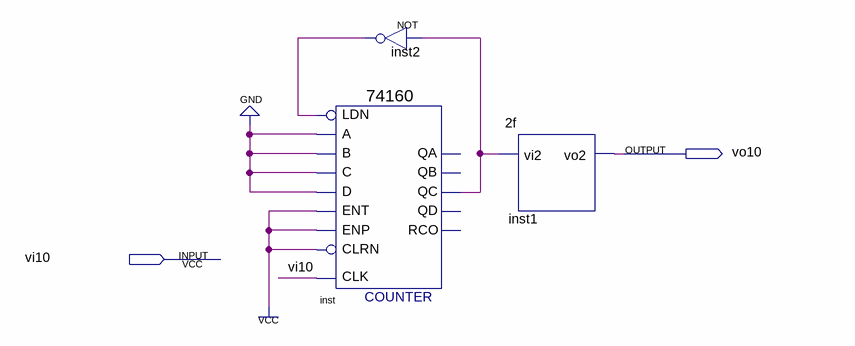
[diagram p0: schematic sheet]
// Quartus schematic 10f.bdf as structural Verilog: 3 symbols, 2 pins
module \10f  (
  input  vi10,
  output vo10
);

  wire inst2_out, inst_qc;

  \74160  inst (
    .CLK(vi10), .ENT(1'b1), .A(1'b0), .B(1'b0), .C(1'b0), .D(1'b0), .LDN(inst2_out), .ENP(1'b1), .CLRN(1'b1),
    .QC(inst_qc));  // open: QD, QA, QB, RCO
  not inst2 (inst2_out, inst_qc);
  \2f  inst1 (.vi2(inst_qc), .vo2(vo10));
endmodule
